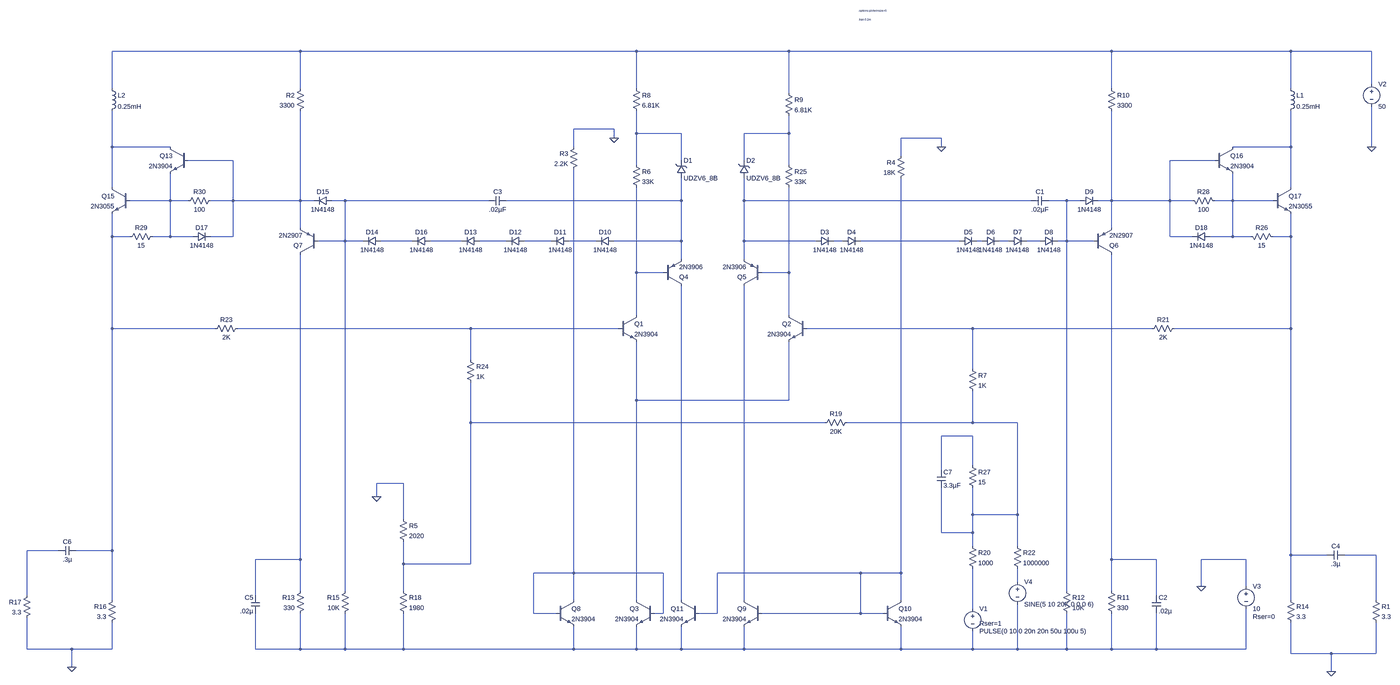
[diagram p0: schematic testamp.asc, whole sheet]
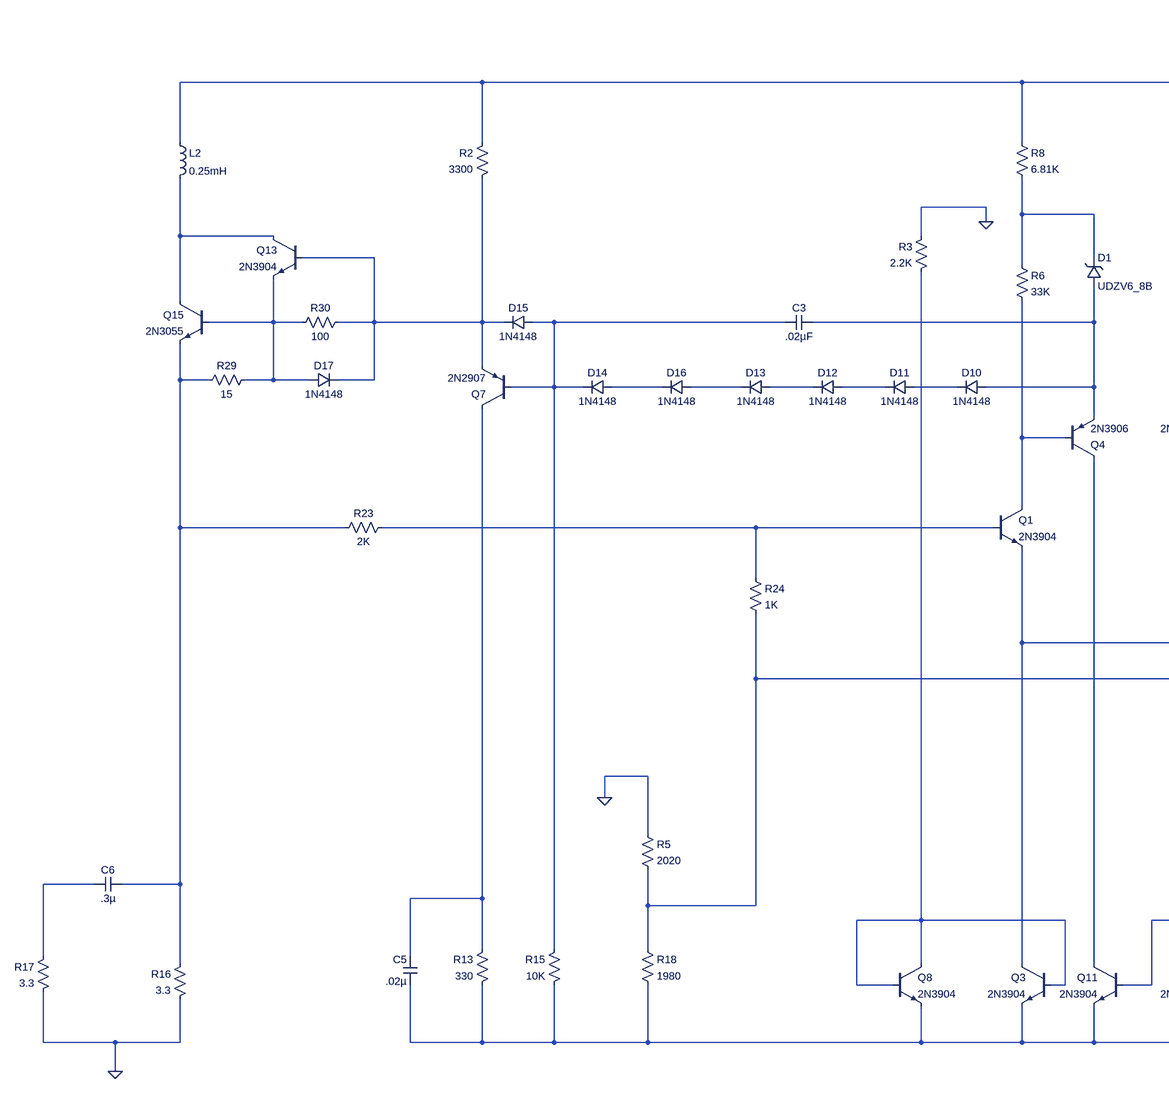
[diagram p1: schematic testamp.asc, part, row 1 of 1, column 1 of 2]
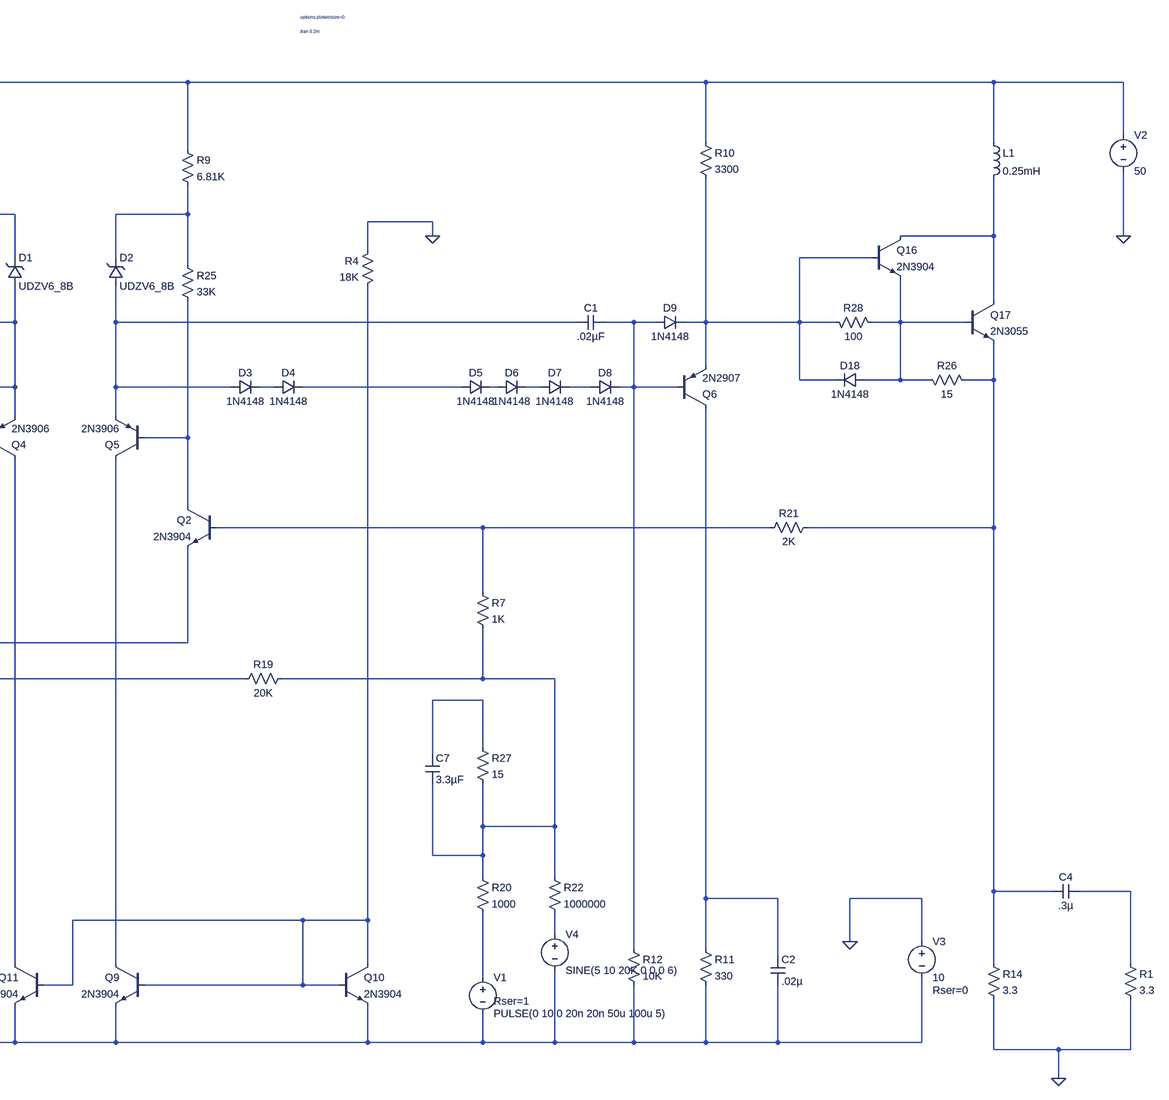
[diagram p2: schematic testamp.asc, part, row 1 of 1, column 2 of 2]
testamp.asc, the LTspice schematic file:
Version 4
SHEET 1 3184 2244
WIRE -1776 -1664 -2448 -1664
WIRE -576 -1664 -1776 -1664
WIRE -32 -1664 -576 -1664
WIRE 1120 -1664 -32 -1664
WIRE 1760 -1664 1120 -1664
WIRE 2048 -1664 1760 -1664
WIRE 2048 -1536 2048 -1664
WIRE -2448 -1520 -2448 -1664
WIRE -1776 -1520 -1776 -1664
WIRE -576 -1520 -576 -1664
WIRE 1120 -1520 1120 -1664
WIRE 1760 -1520 1760 -1664
WIRE -32 -1504 -32 -1664
WIRE -656 -1376 -800 -1376
WIRE -576 -1360 -576 -1440
WIRE -416 -1360 -576 -1360
WIRE -32 -1360 -32 -1424
WIRE -32 -1360 -192 -1360
WIRE -656 -1344 -656 -1376
WIRE 512 -1344 368 -1344
WIRE -2448 -1312 -2448 -1440
WIRE -2240 -1312 -2448 -1312
WIRE -800 -1312 -800 -1376
WIRE 512 -1312 512 -1344
WIRE 1760 -1312 1760 -1440
WIRE 1760 -1312 1552 -1312
WIRE 2048 -1312 2048 -1456
WIRE 368 -1280 368 -1344
WIRE -2016 -1264 -2176 -1264
WIRE -416 -1264 -416 -1360
WIRE -192 -1264 -192 -1360
WIRE 1488 -1264 1328 -1264
WIRE -576 -1248 -576 -1360
WIRE -32 -1248 -32 -1360
WIRE -2448 -1168 -2448 -1312
WIRE 1760 -1168 1760 -1312
WIRE -2240 -1120 -2240 -1216
WIRE -2240 -1120 -2384 -1120
WIRE -2176 -1120 -2240 -1120
WIRE -2016 -1120 -2016 -1264
WIRE -2016 -1120 -2096 -1120
WIRE -1776 -1120 -1776 -1440
WIRE -1776 -1120 -2016 -1120
WIRE -1728 -1120 -1776 -1120
WIRE -1616 -1120 -1664 -1120
WIRE -1104 -1120 -1616 -1120
WIRE -416 -1120 -416 -1200
WIRE -416 -1120 -1040 -1120
WIRE -192 -1120 -192 -1200
WIRE 832 -1120 -192 -1120
WIRE 960 -1120 896 -1120
WIRE 1008 -1120 960 -1120
WIRE 1120 -1120 1120 -1440
WIRE 1120 -1120 1072 -1120
WIRE 1328 -1120 1328 -1264
WIRE 1328 -1120 1120 -1120
WIRE 1408 -1120 1328 -1120
WIRE 1552 -1120 1552 -1216
WIRE 1552 -1120 1488 -1120
WIRE 1696 -1120 1552 -1120
WIRE -1776 -1024 -1776 -1120
WIRE 1120 -1024 1120 -1120
WIRE -2448 -992 -2448 -1072
WIRE -2384 -992 -2448 -992
WIRE -2240 -992 -2240 -1120
WIRE -2240 -992 -2304 -992
WIRE -2160 -992 -2240 -992
WIRE -2016 -992 -2016 -1120
WIRE -2016 -992 -2096 -992
WIRE 1328 -992 1328 -1120
WIRE 1408 -992 1328 -992
WIRE 1552 -992 1552 -1120
WIRE 1552 -992 1472 -992
WIRE 1616 -992 1552 -992
WIRE 1760 -992 1760 -1072
WIRE 1760 -992 1696 -992
WIRE -1616 -976 -1616 -1120
WIRE -1616 -976 -1712 -976
WIRE -1552 -976 -1616 -976
WIRE -1376 -976 -1488 -976
WIRE -1200 -976 -1312 -976
WIRE -1040 -976 -1136 -976
WIRE -880 -976 -976 -976
WIRE -720 -976 -816 -976
WIRE -416 -976 -416 -1120
WIRE -416 -976 -656 -976
WIRE -192 -976 -192 -1120
WIRE 64 -976 -192 -976
WIRE 160 -976 128 -976
WIRE 576 -976 224 -976
WIRE 656 -976 640 -976
WIRE 752 -976 720 -976
WIRE 864 -976 816 -976
WIRE 960 -976 960 -1120
WIRE 960 -976 928 -976
WIRE 1056 -976 960 -976
WIRE -416 -912 -416 -976
WIRE -192 -912 -192 -976
WIRE -576 -864 -576 -1168
WIRE -480 -864 -576 -864
WIRE -32 -864 -32 -1168
WIRE -32 -864 -128 -864
WIRE -576 -592 -576 -864
WIRE -32 -592 -32 -864
WIRE -2448 -544 -2448 -992
WIRE -2080 -544 -2448 -544
WIRE -1168 -544 -2000 -544
WIRE -640 -544 -1168 -544
WIRE 624 -544 32 -544
WIRE 1264 -544 624 -544
WIRE 1760 -544 1760 -992
WIRE 1760 -544 1344 -544
WIRE -1168 -432 -1168 -544
WIRE 624 -400 624 -544
WIRE -576 -288 -576 -496
WIRE -32 -288 -32 -496
WIRE -32 -288 -576 -288
WIRE -1168 -208 -1168 -352
WIRE 96 -208 -1168 -208
WIRE 624 -208 624 -320
WIRE 624 -208 176 -208
WIRE 784 -208 624 -208
WIRE 624 -160 512 -160
WIRE 624 -32 624 -160
WIRE 512 -16 512 -160
WIRE -1408 32 -1504 32
WIRE -1504 80 -1504 32
WIRE 624 144 624 48
WIRE 784 144 784 -208
WIRE 784 144 624 144
WIRE -1408 160 -1408 32
WIRE 512 208 512 48
WIRE 624 208 624 144
WIRE 624 208 512 208
WIRE 624 256 624 208
WIRE 784 256 784 144
WIRE -2640 272 -2752 272
WIRE -2448 272 -2448 -544
WIRE -2448 272 -2576 272
WIRE 1760 288 1760 -544
WIRE 1888 288 1760 288
WIRE 2064 288 1952 288
WIRE -1776 304 -1776 -928
WIRE -1776 304 -1936 304
WIRE 1120 304 1120 -928
WIRE 1280 304 1120 304
WIRE 1600 304 1440 304
WIRE -1408 320 -1408 240
WIRE -1168 320 -1168 -208
WIRE -1168 320 -1408 320
WIRE -800 352 -800 -1232
WIRE -800 352 -944 352
WIRE -480 352 -800 352
WIRE 224 352 -288 352
WIRE 368 352 368 -1200
WIRE 368 352 224 352
WIRE 784 384 784 336
WIRE 1440 400 1440 304
WIRE 1600 400 1600 304
WIRE -1776 416 -1776 304
WIRE -1616 416 -1616 -976
WIRE -1408 416 -1408 320
WIRE 960 416 960 -976
WIRE 1120 416 1120 304
WIRE -2752 432 -2752 272
WIRE -1936 432 -1936 304
WIRE 1280 432 1280 304
WIRE -2448 448 -2448 272
WIRE -800 448 -800 352
WIRE -576 448 -576 -288
WIRE -416 448 -416 -816
WIRE -192 448 -192 -816
WIRE 368 448 368 352
WIRE 1760 448 1760 288
WIRE 2064 448 2064 288
WIRE 624 480 624 336
WIRE -944 496 -944 352
WIRE -864 496 -944 496
WIRE -480 496 -480 352
WIRE -480 496 -512 496
WIRE -288 496 -288 352
WIRE -288 496 -352 496
WIRE 224 496 224 352
WIRE 224 496 -128 496
WIRE 304 496 224 496
WIRE -2752 624 -2752 512
WIRE -2592 624 -2752 624
WIRE -2448 624 -2448 528
WIRE -2448 624 -2592 624
WIRE -1936 624 -1936 496
WIRE -1776 624 -1776 496
WIRE -1776 624 -1936 624
WIRE -1616 624 -1616 496
WIRE -1616 624 -1776 624
WIRE -1408 624 -1408 496
WIRE -1408 624 -1616 624
WIRE -800 624 -800 544
WIRE -800 624 -1408 624
WIRE -576 624 -576 544
WIRE -576 624 -800 624
WIRE -416 624 -416 544
WIRE -416 624 -576 624
WIRE -192 624 -192 544
WIRE -192 624 -416 624
WIRE 368 624 368 544
WIRE 368 624 -192 624
WIRE 624 624 624 560
WIRE 624 624 368 624
WIRE 784 624 784 464
WIRE 784 624 624 624
WIRE 960 624 960 496
WIRE 960 624 784 624
WIRE 1120 624 1120 496
WIRE 1120 624 960 624
WIRE 1280 624 1280 496
WIRE 1280 624 1120 624
WIRE 1600 624 1600 480
WIRE 1600 624 1280 624
WIRE 1760 640 1760 528
WIRE 1904 640 1760 640
WIRE 2064 640 2064 528
WIRE 2064 640 1904 640
WIRE -2592 688 -2592 624
WIRE 1904 704 1904 640
FLAG 1904 704 0
FLAG 2048 -1312 0
FLAG -2592 688 0
FLAG 1440 400 0
FLAG 512 -1312 0
FLAG -1504 80 0
FLAG -656 -1344 0
DATAFLAG -576 -720 ""
DATAFLAG -32 -736 ""
DATAFLAG -112 -976 ""
DATAFLAG -1280 -1120 ""
DATAFLAG 672 -1120 ""
DATAFLAG -1008 624 ""
DATAFLAG 304 -1664 ""
DATAFLAG -304 -288 ""
DATAFLAG 176 -544 ""
DATAFLAG -912 -544 ""
DATAFLAG 1552 -544 ""
DATAFLAG -2272 -544 ""
DATAFLAG -480 -976 ""
DATAFLAG -192 -656 ""
DATAFLAG -416 -656 ""
DATAFLAG -448 -1360 ""
DATAFLAG -160 -1360 ""
DATAFLAG -1616 -784 ""
DATAFLAG 960 -704 ""
SYMBOL voltage 624 464 R0
WINDOW 123 0 0 Left 2
WINDOW 39 24 68 Left 2
SYMATTR SpiceLine Rser=1
SYMATTR InstName V1
SYMATTR Value PULSE(0 10 0 20n 20n 50u 100u 5)
SYMBOL npn -640 -592 R0
SYMATTR InstName Q1
SYMATTR Value 2N3904
SYMBOL npn 32 -592 M0
SYMATTR InstName Q2
SYMATTR Value 2N3904
SYMBOL pnp -480 -816 M180
SYMATTR InstName Q4
SYMATTR Value 2N3906
SYMBOL pnp -128 -816 R180
SYMATTR InstName Q5
SYMATTR Value 2N3906
SYMBOL res -592 -1264 R0
SYMATTR InstName R6
SYMATTR Value 33K
SYMBOL res 608 -416 R0
SYMATTR InstName R7
SYMATTR Value 1K
SYMBOL res -592 -1536 R0
SYMATTR InstName R8
SYMATTR Value 6.81K
SYMBOL res -48 -1520 R0
SYMATTR InstName R9
SYMATTR Value 6.81K
SYMBOL diode 64 -960 R270
WINDOW 0 32 32 VTop 2
WINDOW 3 0 32 VBottom 2
SYMATTR InstName D3
SYMATTR Value 1N4148
SYMBOL diode 160 -960 R270
WINDOW 0 32 32 VTop 2
WINDOW 3 0 32 VBottom 2
SYMATTR InstName D4
SYMATTR Value 1N4148
SYMBOL diode 576 -960 R270
WINDOW 0 32 32 VTop 2
WINDOW 3 0 32 VBottom 2
SYMATTR InstName D5
SYMATTR Value 1N4148
SYMBOL diode 656 -960 R270
WINDOW 0 32 32 VTop 2
WINDOW 3 0 32 VBottom 2
SYMATTR InstName D6
SYMATTR Value 1N4148
SYMBOL diode 752 -960 R270
WINDOW 0 32 32 VTop 2
WINDOW 3 0 32 VBottom 2
SYMATTR InstName D7
SYMATTR Value 1N4148
SYMBOL diode 864 -960 R270
WINDOW 0 32 32 VTop 2
WINDOW 3 0 32 VBottom 2
SYMATTR InstName D8
SYMATTR Value 1N4148
SYMBOL cap 896 -1136 R90
WINDOW 0 0 32 VBottom 2
WINDOW 3 32 32 VTop 2
SYMATTR InstName C1
SYMATTR Value .02µF
SYMBOL res 1104 -1536 R0
SYMATTR InstName R10
SYMATTR Value 3300
SYMBOL pnp 1056 -928 M180
SYMATTR InstName Q6
SYMATTR Value 2N2907
SYMBOL diode 1008 -1104 R270
WINDOW 0 32 32 VTop 2
WINDOW 3 0 32 VBottom 2
SYMATTR InstName D9
SYMATTR Value 1N4148
SYMBOL res 1104 400 R0
SYMATTR InstName R11
SYMATTR Value 330
SYMBOL res 944 400 R0
SYMATTR InstName R12
SYMATTR Value 10K
SYMBOL cap 1264 432 R0
SYMATTR InstName C2
SYMATTR Value .02µ
SYMBOL res 1744 432 R0
SYMATTR InstName R14
SYMATTR Value 3.3
SYMBOL cap 1952 272 R90
WINDOW 0 0 32 VBottom 2
WINDOW 3 32 32 VTop 2
SYMATTR InstName C4
SYMATTR Value .3µ
SYMBOL res 2048 432 R0
SYMATTR InstName R1
SYMATTR Value 3.3
SYMBOL voltage 2048 -1552 R0
WINDOW 123 0 0 Left 2
WINDOW 39 0 0 Left 2
SYMATTR InstName V2
SYMATTR Value 50
SYMBOL diode -656 -960 M270
WINDOW 0 32 32 VTop 2
WINDOW 3 0 32 VBottom 2
SYMATTR InstName D10
SYMATTR Value 1N4148
SYMBOL diode -816 -960 M270
WINDOW 0 32 32 VTop 2
WINDOW 3 0 32 VBottom 2
SYMATTR InstName D11
SYMATTR Value 1N4148
SYMBOL diode -976 -960 M270
WINDOW 0 32 32 VTop 2
WINDOW 3 0 32 VBottom 2
SYMATTR InstName D12
SYMATTR Value 1N4148
SYMBOL diode -1136 -960 M270
WINDOW 0 32 32 VTop 2
WINDOW 3 0 32 VBottom 2
SYMATTR InstName D13
SYMATTR Value 1N4148
SYMBOL diode -1488 -960 M270
WINDOW 0 32 32 VTop 2
WINDOW 3 0 32 VBottom 2
SYMATTR InstName D14
SYMATTR Value 1N4148
SYMBOL cap -1104 -1136 M90
WINDOW 0 0 32 VBottom 2
WINDOW 3 32 32 VTop 2
SYMATTR InstName C3
SYMATTR Value .02µF
SYMBOL res -1760 -1536 M0
SYMATTR InstName R2
SYMATTR Value 3300
SYMBOL pnp -1712 -928 R180
SYMATTR InstName Q7
SYMATTR Value 2N2907
SYMBOL diode -1664 -1104 M270
WINDOW 0 32 32 VTop 2
WINDOW 3 0 32 VBottom 2
SYMATTR InstName D15
SYMATTR Value 1N4148
SYMBOL res -1760 400 M0
SYMATTR InstName R13
SYMATTR Value 330
SYMBOL res -1600 400 M0
SYMATTR InstName R15
SYMATTR Value 10K
SYMBOL cap -1920 432 M0
SYMATTR InstName C5
SYMATTR Value .02µ
SYMBOL res -2432 432 M0
SYMATTR InstName R16
SYMATTR Value 3.3
SYMBOL cap -2640 256 M90
WINDOW 0 0 32 VBottom 2
WINDOW 3 32 32 VTop 2
SYMATTR InstName C6
SYMATTR Value .3µ
SYMBOL res -2736 416 M0
SYMATTR InstName R17
SYMATTR Value 3.3
SYMBOL res 1360 -560 R90
WINDOW 0 0 56 VBottom 2
WINDOW 3 32 56 VTop 2
SYMATTR InstName R21
SYMATTR Value 2K
SYMBOL res -1984 -560 R90
WINDOW 0 0 56 VBottom 2
WINDOW 3 32 56 VTop 2
SYMATTR InstName R23
SYMATTR Value 2K
SYMBOL res -1184 -448 R0
SYMATTR InstName R24
SYMATTR Value 1K
SYMBOL res -48 -1264 R0
SYMATTR InstName R25
SYMATTR Value 33K
SYMBOL diode -1312 -960 M270
WINDOW 0 32 32 VTop 2
WINDOW 3 0 32 VBottom 2
SYMATTR InstName D16
SYMATTR Value 1N4148
SYMBOL zener -432 -1200 M180
WINDOW 0 24 64 Left 2
WINDOW 3 24 0 Left 2
SYMATTR InstName D1
SYMATTR Value UDZV6_8B
SYMBOL zener -208 -1200 M180
WINDOW 0 24 64 Left 2
WINDOW 3 24 0 Left 2
SYMATTR InstName D2
SYMATTR Value UDZV6_8B
SYMBOL voltage 1600 384 R0
WINDOW 123 0 0 Left 2
WINDOW 39 24 124 Left 2
SYMATTR SpiceLine Rser=0
SYMATTR InstName V3
SYMATTR Value 10
SYMBOL ind 1744 -1536 R0
SYMATTR InstName L1
SYMATTR Value 0.25mH
SYMATTR SpiceLine Ipk=1000 Rser=1 Rpar=680 Cpar=.00001uf
SYMBOL ind -2464 -1536 R0
SYMATTR InstName L2
SYMATTR Value 0.25mH
SYMATTR SpiceLine Ipk=1000 Rser=1 Rpar=680 Cpar=.00001uf
SYMBOL npn -512 448 M0
SYMATTR InstName Q3
SYMATTR Value 2N3904
SYMBOL npn -128 448 M0
SYMATTR InstName Q9
SYMATTR Value 2N3904
SYMBOL npn 304 448 R0
SYMATTR InstName Q10
SYMATTR Value 2N3904
SYMBOL res 384 -1296 M0
SYMATTR InstName R4
SYMATTR Value 18K
SYMBOL npn -352 448 M0
SYMATTR InstName Q11
SYMATTR Value 2N3904
SYMBOL res -1424 144 R0
SYMATTR InstName R5
SYMATTR Value 2020
SYMBOL res -1424 400 R0
SYMATTR InstName R18
SYMATTR Value 1980
SYMBOL res 192 -224 R90
WINDOW 0 0 56 VBottom 2
WINDOW 3 32 56 VTop 2
SYMATTR InstName R19
SYMATTR Value 20K
SYMBOL res 608 240 R0
SYMATTR InstName R20
SYMATTR Value 1000
SYMBOL npn -2176 -1312 M0
SYMATTR InstName Q13
SYMATTR Value 2N3904
SYMBOL npn -2384 -1168 M0
SYMATTR InstName Q15
SYMATTR Value 2N3055
SYMBOL res -2288 -1008 R90
WINDOW 0 0 56 VBottom 2
WINDOW 3 32 56 VTop 2
SYMATTR InstName R29
SYMATTR Value 15
SYMBOL res -2080 -1136 R90
WINDOW 0 0 56 VBottom 2
WINDOW 3 32 56 VTop 2
SYMATTR InstName R30
SYMATTR Value 100
SYMBOL diode -2160 -976 R270
WINDOW 0 32 32 VTop 2
WINDOW 3 0 32 VBottom 2
SYMATTR InstName D17
SYMATTR Value 1N4148
SYMBOL npn 1488 -1312 R0
SYMATTR InstName Q16
SYMATTR Value 2N3904
SYMBOL npn 1696 -1168 R0
SYMATTR InstName Q17
SYMATTR Value 2N3055
SYMBOL res 1600 -1008 M90
WINDOW 0 0 56 VBottom 2
WINDOW 3 32 56 VTop 2
SYMATTR InstName R26
SYMATTR Value 15
SYMBOL res 1392 -1136 M90
WINDOW 0 0 56 VBottom 2
WINDOW 3 32 56 VTop 2
SYMATTR InstName R28
SYMATTR Value 100
SYMBOL diode 1472 -976 M270
WINDOW 0 32 32 VTop 2
WINDOW 3 0 32 VBottom 2
SYMATTR InstName D18
SYMATTR Value 1N4148
SYMBOL voltage 784 368 R0
WINDOW 123 0 0 Left 2
WINDOW 39 0 0 Left 2
SYMATTR InstName V4
SYMATTR Value SINE(5 10 20K 0 0 0 6)
SYMBOL npn -864 448 R0
SYMATTR InstName Q8
SYMATTR Value 2N3904
SYMBOL res -784 -1328 M0
SYMATTR InstName R3
SYMATTR Value 2.2K
SYMBOL res 768 240 R0
SYMATTR InstName R22
SYMATTR Value 1000000
SYMBOL res 608 -48 R0
SYMATTR InstName R27
SYMATTR Value 15
SYMBOL cap 496 -16 R0
SYMATTR InstName C7
SYMATTR Value 3.3µF
TEXT 216 -1776 Left 0 !.tran 0.2m
TEXT 216 -1808 Left 0 !.options plotwinsize=0

The netlist it stands for:
* testamp.asc
V1 N043 N044 PULSE(0 10 0 20n 20n 50u 100u 5) Rser=1
Q1 N026 N028 N030 0 2N3904
Q2 N027 N029 N030 0 2N3904
Q4 N041 N026 N010 0 2N3906
Q5 N042 N027 N011 0 2N3906
R6 N002 N026 33K
R7 N029 N032 1K
R8 N001 N002 6.81K
R9 N001 N003 6.81K
D3 N011 N021 1N4148
D4 N021 N022 1N4148
D5 N022 N023 1N4148
D6 N023 N024 1N4148
D7 N024 N025 1N4148
D8 N025 N012 1N4148
C1 N012 N011 .02µF
R10 N001 N007 3300
Q6 N037 N012 N007 0 2N2907
D9 N012 N007 1N4148
R11 N037 N044 330
R12 N012 N044 10K
C2 N037 N044 .02µ
R14 N015 0 3.3
C4 N035 N015 .3µ
R1 N035 0 3.3
V2 N001 0 50
D10 N010 N020 1N4148
D11 N020 N019 1N4148
D12 N019 N018 1N4148
D13 N018 N017 1N4148
D14 N016 N009 1N4148
C3 N009 N010 .02µF
R2 N001 N006 3300
Q7 N036 N009 N006 0 2N2907
D15 N009 N006 1N4148
R13 N036 N044 330
R15 N009 N044 10K
C5 N036 N044 .02µ
R16 N014 0 3.3
C6 N034 N014 .3µ
R17 N034 0 3.3
R21 N015 N029 2K
R23 N028 N014 2K
R24 N028 N031 1K
R25 N003 N027 33K
D16 N017 N016 1N4148
D1 N010 N002 UDZV6_8B
D2 N011 N003 UDZV6_8B
V3 0 N044 10 Rser=0
L1 N001 N005 0.25mH Ipk=1000 Rser=1 Rpar=680 Cpar=.00001uf
L2 N001 N004 0.25mH Ipk=1000 Rser=1 Rpar=680 Cpar=.00001uf
Q3 N030 N038 N044 0 2N3904
Q9 N042 N039 N044 0 2N3904
Q10 N039 N039 N044 0 2N3904
R4 0 N039 18K
Q11 N041 N039 N044 0 2N3904
R5 0 N031 2020
R18 N031 N044 1980
R19 N032 N031 20K
R20 N032 N043 1000
Q13 N004 N006 N008 0 2N3904
Q15 N004 N008 N014 0 2N3055
R29 N008 N014 15
R30 N006 N008 100
D17 N008 N006 1N4148
Q16 N005 N007 N013 0 2N3904
Q17 N005 N013 N015 0 2N3055
R26 N013 N015 15
R28 N007 N013 100
D18 N013 N007 1N4148
V4 N040 N044 SINE(5 10 20K 0 0 0 6)
Q8 N038 N038 N044 0 2N3904
R3 0 N038 2.2K
R22 N032 N040 1000000
R27 N033 N032 15
C7 N033 N032 3.3µF
.model D D
.lib standard.dio
.model NPN NPN
.model PNP PNP
.lib standard.bjt
.tran 0.2m
.options plotwinsize=0
.backanno
.end